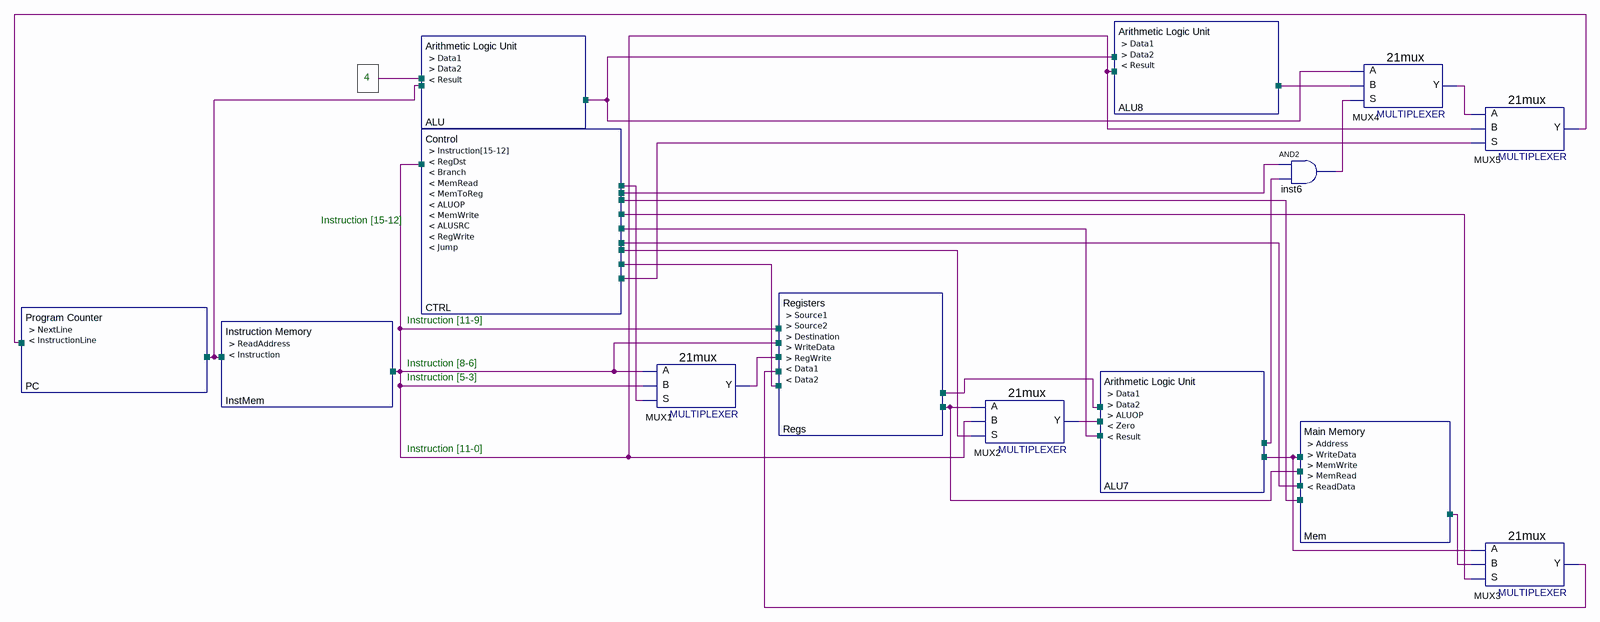
[diagram p0: schematic sheet]
// Quartus schematic Project.bdf as structural Verilog: 14 symbols, 0 pins
module Project (
);

  wire ALUOP, Data1, Data2, inst6_out, MemRead, MemWrite, MUX1_y, MUX2_y, MUX3_y, MUX4_y, MUX5_y, RegWrite,
       Result, undriven, undriven_2, undriven_3, undriven_4, undriven_5, undriven_6, undriven_7, undriven_8,
       undriven_9, undriven_10, undriven_11, undriven_12, WriteData;

  \Program_Counter  PC ();  // open: NextLine, InstructionLine
  \Instruction_Memory  InstMem ();  // open: ReadAddress, Instruction
  \Arithmetic_Logic_Unit  ALU (.Data1(Data1), .Data2(Data2), .Result(Result));
  Control CTRL (
    .MemRead(MemRead), .ALUOP(ALUOP), .MemWrite(MemWrite), .RegWrite(RegWrite));  // open: Instruction[15-12], RegDst, Branch, MemToReg, ALUSRC, Jump
  \21mux  MUX1 (.S(undriven), .B(undriven_12), .A(undriven_12), .Y(MUX1_y));
  Registers Regs (
    .WriteData(WriteData), .RegWrite(RegWrite), .Data1(Data1), .Data2(Data2));  // open: Source1, Source2, Destination
  \21mux  MUX2 (.S(undriven_3), .B(undriven_12), .A(undriven_2), .Y(MUX2_y));
  \Arithmetic_Logic_Unit  ALU8 (.Data1(Data1), .Data2(Data2), .Result(Result));
  \Arithmetic_Logic_Unit  ALU7 (.Data1(Data1), .Data2(Data2), .ALUOP(ALUOP));  // open: Zero, Result
  and inst6 (inst6_out, undriven_4, undriven_8);
  \Main_Memory  Mem (.WriteData(WriteData), .MemWrite(MemWrite), .MemRead(MemRead));  // open: Address, ReadData
  \21mux  MUX4 (.S(inst6_out), .B(undriven_10), .A(undriven_9), .Y(MUX4_y));
  \21mux  MUX5 (.S(undriven_11), .B(undriven_12), .A(MUX4_y), .Y(MUX5_y));
  \21mux  MUX3 (.S(undriven_5), .B(undriven_7), .A(undriven_6), .Y(MUX3_y));

  // Notes on the sheet:
  //   4
  //   Instruction [15-12]
  //   Instruction [11-9]
  //   Instruction [8-6]
  //   Instruction [5-3]
  //   Instruction [11-0]
endmodule
